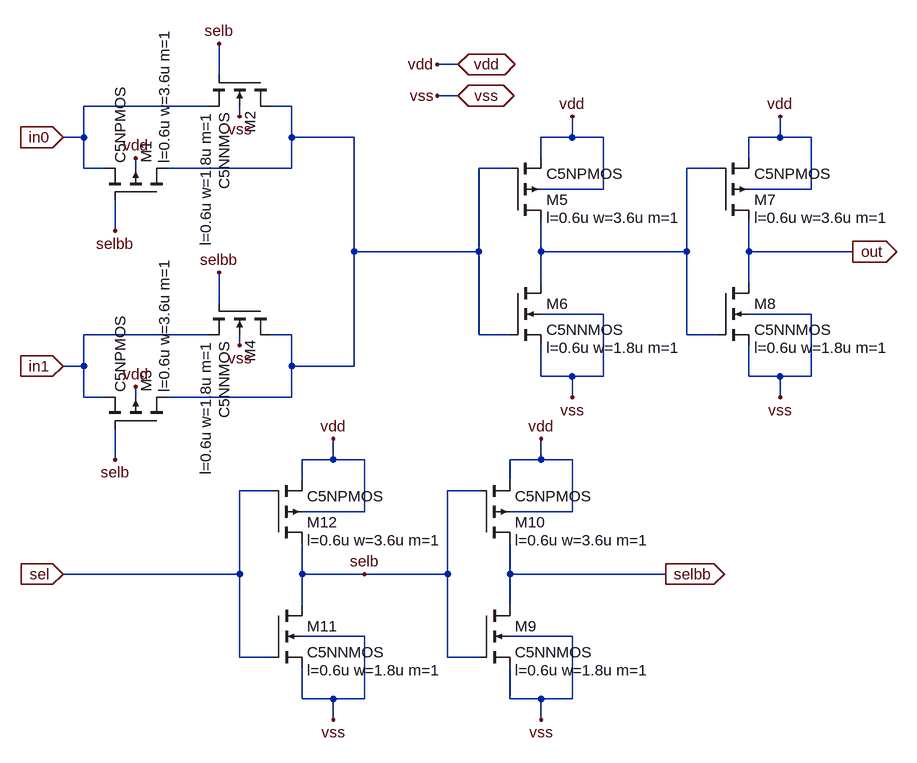
[diagram p0: schematic mux2to1_1x.asc]
mux2to1_1x.asc, the LTspice schematic file:
Version 4
SHEET 1 1232 964
WIRE 528 -128 496 -128
WIRE 160 -112 160 -160
WIRE 528 -80 496 -80
WIRE 144 -64 -48 -64
WIRE 272 -64 240 -64
WIRE 192 -48 192 -64
WIRE -48 -16 -48 -64
WIRE -48 -16 -80 -16
WIRE 272 -16 272 -64
WIRE 368 -16 272 -16
WIRE 704 -16 704 -48
WIRE 704 -16 656 -16
WIRE 752 -16 704 -16
WIRE 1024 -16 1024 -48
WIRE 1024 -16 976 -16
WIRE 1072 -16 1024 -16
WIRE 656 16 656 -16
WIRE 976 16 976 -16
WIRE -48 32 -48 -16
WIRE -16 32 -48 32
WIRE 32 32 32 16
WIRE 272 32 272 -16
WIRE 272 32 80 32
WIRE 608 32 560 32
WIRE 928 32 880 32
WIRE 752 64 752 -16
WIRE 752 64 656 64
WIRE 1072 64 1072 -16
WIRE 1072 64 976 64
WIRE 0 128 0 80
WIRE 368 160 368 -16
WIRE 560 160 560 32
WIRE 560 160 368 160
WIRE 656 160 656 112
WIRE 880 160 880 32
WIRE 880 160 656 160
WIRE 976 160 976 112
WIRE 1136 160 976 160
WIRE 656 208 656 160
WIRE 976 208 976 160
WIRE 160 240 160 192
WIRE 752 256 656 256
WIRE 1072 256 976 256
WIRE 144 288 -48 288
WIRE 272 288 240 288
WIRE 560 288 560 160
WIRE 608 288 560 288
WIRE 880 288 880 160
WIRE 928 288 880 288
WIRE 192 304 192 288
WIRE -48 336 -48 288
WIRE -48 336 -80 336
WIRE 272 336 272 288
WIRE 368 336 368 160
WIRE 368 336 272 336
WIRE 656 352 656 304
WIRE 704 352 656 352
WIRE 752 352 752 256
WIRE 752 352 704 352
WIRE 976 352 976 304
WIRE 1024 352 976 352
WIRE 1072 352 1072 256
WIRE 1072 352 1024 352
WIRE -48 384 -48 336
WIRE -16 384 -48 384
WIRE 32 384 32 368
WIRE 272 384 272 336
WIRE 272 384 80 384
WIRE 704 384 704 352
WIRE 1024 384 1024 352
WIRE 0 480 0 432
WIRE 336 480 336 448
WIRE 336 480 288 480
WIRE 384 480 336 480
WIRE 656 480 656 448
WIRE 656 480 608 480
WIRE 704 480 656 480
WIRE 288 512 288 480
WIRE 608 512 608 480
WIRE 240 528 192 528
WIRE 560 528 512 528
WIRE 384 560 384 480
WIRE 384 560 288 560
WIRE 704 560 704 480
WIRE 704 560 608 560
WIRE 192 656 192 528
WIRE 192 656 -80 656
WIRE 288 656 288 608
WIRE 384 656 288 656
WIRE 512 656 512 528
WIRE 512 656 384 656
WIRE 608 656 608 608
WIRE 848 656 608 656
WIRE 288 704 288 656
WIRE 608 704 608 656
WIRE 384 752 288 752
WIRE 704 752 608 752
WIRE 192 784 192 656
WIRE 240 784 192 784
WIRE 512 784 512 656
WIRE 560 784 512 784
WIRE 288 848 288 800
WIRE 336 848 288 848
WIRE 384 848 384 752
WIRE 384 848 336 848
WIRE 608 848 608 800
WIRE 656 848 608 848
WIRE 704 848 704 752
WIRE 704 848 656 848
WIRE 336 880 336 848
WIRE 656 880 656 848
FLAG -80 -16 in0
IOPIN -80 -16 In
FLAG 1136 160 out
IOPIN 1136 160 Out
FLAG 528 -80 vss
IOPIN 528 -80 BiDir
FLAG 528 -128 vdd
IOPIN 528 -128 BiDir
FLAG -80 336 in1
IOPIN -80 336 In
FLAG 160 -160 selb
FLAG 0 128 selbb
FLAG 0 480 selb
FLAG 160 192 selbb
FLAG 704 -48 vdd
FLAG 1024 -48 vdd
FLAG 704 384 vss
FLAG 1024 384 vss
FLAG 192 -48 vss
FLAG 32 16 vdd
FLAG 32 368 vdd
FLAG 192 304 vss
FLAG 496 -128 vdd
FLAG 496 -80 vss
FLAG 336 448 vdd
FLAG 656 448 vdd
FLAG 336 880 vss
FLAG 656 880 vss
FLAG -80 656 sel
IOPIN -80 656 In
FLAG 384 656 selb
FLAG 848 656 selbb
IOPIN 848 656 Out
SYMBOL nmos4 928 208 R0
WINDOW 123 56 100 Left 2
SYMATTR Value2 l=0.6u w=1.8u m=1
SYMATTR InstName M8
SYMATTR Value C5NNMOS
SYMBOL pmos4 928 112 M180
WINDOW 123 56 4 Left 2
SYMATTR Value2 l=0.6u w=3.6u m=1
SYMATTR InstName M7
SYMATTR Value C5NPMOS
SYMBOL nmos4 608 208 R0
WINDOW 123 56 100 Left 2
SYMATTR Value2 l=0.6u w=1.8u m=1
SYMATTR InstName M6
SYMATTR Value C5NNMOS
SYMBOL pmos4 608 112 M180
WINDOW 123 56 4 Left 2
SYMATTR Value2 l=0.6u w=3.6u m=1
SYMATTR InstName M5
SYMATTR Value C5NPMOS
SYMBOL nmos4 240 -112 R90
WINDOW 123 56 100 Left 2
SYMATTR Value2 l=0.6u w=1.8u m=1
SYMATTR InstName M2
SYMATTR Value C5NNMOS
SYMBOL pmos4 80 80 M270
WINDOW 123 56 4 Left 2
SYMATTR Value2 l=0.6u w=3.6u m=1
SYMATTR InstName M1
SYMATTR Value C5NPMOS
SYMBOL nmos4 240 240 R90
WINDOW 123 56 100 Left 2
SYMATTR Value2 l=0.6u w=1.8u m=1
SYMATTR InstName M4
SYMATTR Value C5NNMOS
SYMBOL pmos4 80 432 M270
WINDOW 123 56 4 Left 2
SYMATTR Value2 l=0.6u w=3.6u m=1
SYMATTR InstName M3
SYMATTR Value C5NPMOS
SYMBOL nmos4 560 704 R0
WINDOW 123 56 100 Left 2
SYMATTR Value2 l=0.6u w=1.8u m=1
SYMATTR InstName M9
SYMATTR Value C5NNMOS
SYMBOL pmos4 560 608 M180
WINDOW 123 56 4 Left 2
SYMATTR Value2 l=0.6u w=3.6u m=1
SYMATTR InstName M10
SYMATTR Value C5NPMOS
SYMBOL nmos4 240 704 R0
WINDOW 123 56 100 Left 2
SYMATTR Value2 l=0.6u w=1.8u m=1
SYMATTR InstName M11
SYMATTR Value C5NNMOS
SYMBOL pmos4 240 608 M180
WINDOW 123 56 4 Left 2
SYMATTR Value2 l=0.6u w=3.6u m=1
SYMATTR InstName M12
SYMATTR Value C5NPMOS

The netlist it stands for:
* mux2to1_1x.asc
M8 out N002 vss vss C5NNMOS l=0.6u w=1.8u m=1
M7 out N002 vdd vdd C5NPMOS l=0.6u w=3.6u m=1
M6 N002 N001 vss vss C5NNMOS l=0.6u w=1.8u m=1
M5 N002 N001 vdd vdd C5NPMOS l=0.6u w=3.6u m=1
M2 N001 selb in0 vss C5NNMOS l=0.6u w=1.8u m=1
M1 N001 selbb in0 vdd C5NPMOS l=0.6u w=3.6u m=1
M4 N001 selbb in1 vss C5NNMOS l=0.6u w=1.8u m=1
M3 N001 selb in1 vdd C5NPMOS l=0.6u w=3.6u m=1
M9 selbb selb vss vss C5NNMOS l=0.6u w=1.8u m=1
M10 selbb selb vdd vdd C5NPMOS l=0.6u w=3.6u m=1
M11 selb sel vss vss C5NNMOS l=0.6u w=1.8u m=1
M12 selb sel vdd vdd C5NPMOS l=0.6u w=3.6u m=1
.model NMOS NMOS
.model PMOS PMOS
.lib standard.mos
.backanno
.end